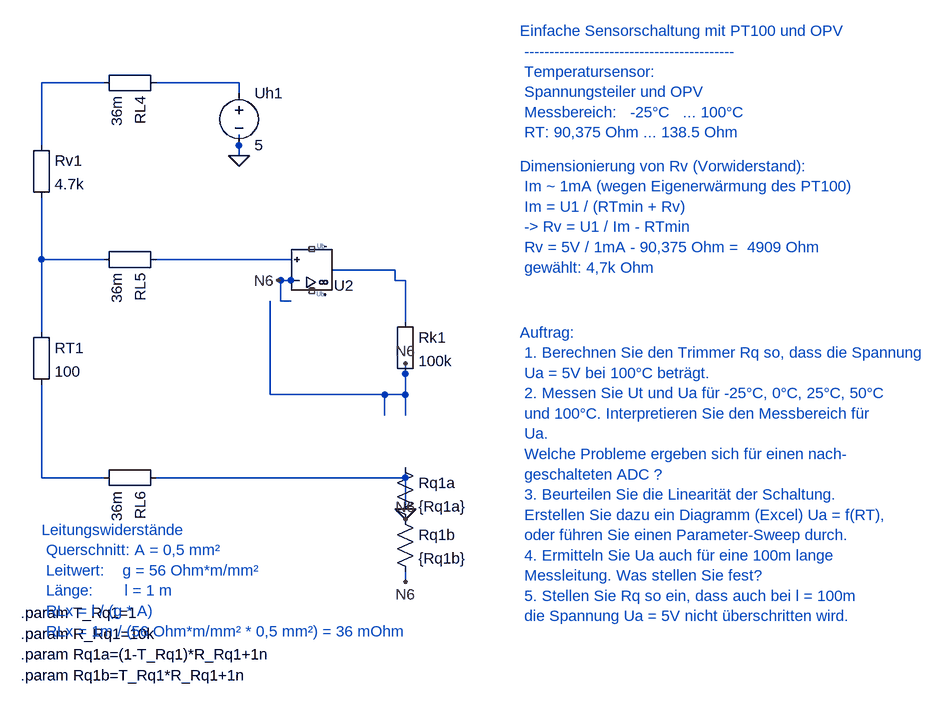
[diagram p0: schematic 1_2_PT100-Sensor_mit_OPV.asc]
1_2_PT100-Sensor_mit_OPV.asc, the LTspice schematic file:
Version 4
SHEET 1 880 680
WIRE 480 448 464 448
WIRE 464 448 464 480
WIRE 464 480 480 480
WIRE 544 432 640 432
WIRE 640 432 640 448
WIRE 400 240 400 224
WIRE 192 144 96 144
WIRE 96 144 96 240
WIRE 96 416 96 528
WIRE 192 416 96 416
WIRE 96 608 96 752
WIRE 96 752 192 752
WIRE 656 512 656 448
WIRE 656 448 640 448
WIRE 656 592 656 624
WIRE 656 800 656 752
WIRE 400 160 400 144
WIRE 400 144 272 144
WIRE 400 224 400 256
WIRE 272 416 480 416
WIRE 96 320 96 416
WIRE 656 624 624 624
WIRE 656 656 656 624
WIRE 624 624 448 624
WIRE 448 624 448 480
WIRE 624 656 624 624
WIRE 656 752 272 752
WIRE 656 736 656 752
WIRE 656 592 656 576
WIRE 656 896 656 912
WIRE 480 448 460 448
FLAG 400 256 0
FLAG 656 800 0
FLAG 656 800 0
FLAG 400 256 0
FLAG 656 576 N6
FLAG 656 912 N6
FLAG 460 448 N6
FLAG 656 816 N6
SYMBOL UniversalOpAmp2 512 432 M180
SYMATTR InstName U2
SYMATTR Value UniversalOpAmp2
SYMBOL Misc\EuropeanResistor 80 512 R0
SYMATTR InstName RT1
SYMATTR Value 100
SYMBOL Misc\EuropeanResistor 288 128 R90
SYMATTR InstName RL4
SYMATTR Value 36m
SYMBOL Misc\EuropeanResistor 288 400 R90
SYMATTR InstName RL5
SYMATTR Value 36m
SYMBOL Misc\EuropeanResistor 288 736 R90
SYMATTR InstName RL6
SYMATTR Value 36m
SYMBOL Misc\EuropeanResistor 640 496 R0
SYMATTR InstName Rk1
SYMATTR Value 100k
SYMBOL voltage 400 144 R0
SYMATTR InstName Uh1
SYMATTR Value 5
SYMBOL Misc\EuropeanResistor 80 224 R0
SYMATTR InstName Rv1
SYMATTR Value 4.7k
SYMBOL res 640 720 R0
SYMATTR InstName Rq1a
SYMATTR Value {Rq1a}
SYMBOL res 640 800 R0
SYMATTR InstName Rq1b
SYMATTR Value {Rq1b}
TEXT 64 960 Left 2 !.param T_Rq1=1
TEXT 64 992 Left 2 !.param R_Rq1=10k
TEXT 64 1024 Left 2 !.param Rq1a=(1-T_Rq1)*R_Rq1+1n
TEXT 64 1056 Left 2 !.param Rq1b=T_Rq1*R_Rq1+1n
TEXT 832 64 Left 2 ;Einfache Sensorschaltung mit PT100 und OPV \n ------------------------------------------ \n Temperatursensor: \n Spannungsteiler und OPV \n Messbereich:   -25°C   ... 100°C \n RT: 90,375 Ohm ... 138.5 Ohm
TEXT 96 832 Left 2 ;Leitungswiderstände \n Querschnitt: A = 0,5 mm² \n Leitwert:    g = 56 Ohm*m/mm² \n Länge:       l = 1 m \n RLx = l / (g * A) \n RLx = 1m / (56 Ohm*m/mm² * 0,5 mm²) = 36 mOhm
TEXT 832 272 Left 2 ;Dimensionierung von Rv (Vorwiderstand): \n Im ~ 1mA (wegen Eigenerwärmung des PT100) \n Im = U1 / (RTmin + Rv) \n -> Rv = U1 / Im - RTmin \n Rv = 5V / 1mA - 90,375 Ohm =  4909 Ohm \n gewählt: 4,7k Ohm
TEXT 832 528 Left 2 ;Auftrag: \n 1. Berechnen Sie den Trimmer Rq so, dass die Spannung \n Ua = 5V bei 100°C beträgt. \n 2. Messen Sie Ut und Ua für -25°C, 0°C, 25°C, 50°C \n und 100°C. Interpretieren Sie den Messbereich für \n Ua. \n Welche Probleme ergeben sich für einen nach- \n geschalteten ADC ? \n 3. Beurteilen Sie die Linearität der Schaltung. \n Erstellen Sie dazu ein Diagramm (Excel) Ua = f(RT), \n oder führen Sie einen Parameter-Sweep durch. \n 4. Ermitteln Sie Ua auch für eine 100m lange \n Messleitung. Was stellen Sie fest? \n 5. Stellen Sie Rq so ein, dass auch bei l = 100m \n die Spannung Ua = 5V nicht überschritten wird.

The netlist it stands for:
* 1_2_PT100-Sensor_mit_OPV.asc
XU2 N006 N6 NC_01 NC_02 N001 level2 UniversalOpAmp2 Avol=1Meg GBW=10Meg Slew=10Meg Ilimit=25m Rail=0 Vos=0 En=0 Enk=0 In=0 Ink=0 Rin=500Meg  ; pins In+ In- V+ V- OUT
RT1 N003 N004 100
RL4 N005 N002 36m
RL5 N006 N003 36m
RL6 0 N004 36m
Rk1 N001 N6 100k
V§Uh1 N005 0 5
Rv1 N002 N003 4.7k
Rq1a 0 N6 {Rq1a}
Rq1b N6 N6 {Rq1b}
.param T_Rq1=1
.param R_Rq1=10k
.param Rq1a=(1-T_Rq1)*R_Rq1+1n
.param Rq1b=T_Rq1*R_Rq1+1n
* Einfache Sensorschaltung mit PT100 und OPV
*  ------------------------------------------
*  Temperatursensor:
*  Spannungsteiler und OPV
*  Messbereich:   -25°C   ... 100°C
*  RT: 90,375 Ohm ... 138.5 Ohm
* Leitungswiderstände
*  Querschnitt: A = 0,5 mm²
*  Leitwert:    g = 56 Ohm*m/mm²
*  Länge:       l = 1 m
*  RLx = l / (g * A)
*  RLx = 1m / (56 Ohm*m/mm² * 0,5 mm²) = 36 mOhm
* Dimensionierung von Rv (Vorwiderstand):
*  Im ~ 1mA (wegen Eigenerwärmung des PT100)
*  Im = U1 / (RTmin + Rv)
*  -> Rv = U1 / Im - RTmin
*  Rv = 5V / 1mA - 90,375 Ohm =  4909 Ohm
*  gewählt: 4,7k Ohm
* Auftrag:
*  1. Berechnen Sie den Trimmer Rq so, dass die Spannung
*  Ua = 5V bei 100°C beträgt.
*  2. Messen Sie Ut und Ua für -25°C, 0°C, 25°C, 50°C
*  und 100°C. Interpretieren Sie den Messbereich für
*  Ua.
*  Welche Probleme ergeben sich für einen nach-
*  geschalteten ADC ?
*  3. Beurteilen Sie die Linearität der Schaltung.
*  Erstellen Sie dazu ein Diagramm (Excel) Ua = f(RT),
*  oder führen Sie einen Parameter-Sweep durch.
*  4. Ermitteln Sie Ua auch für eine 100m lange
*  Messleitung. Was stellen Sie fest?
*  5. Stellen Sie Rq so ein, dass auch bei l = 100m
*  die Spannung Ua = 5V nicht überschritten wird.
.lib UniversalOpAmp2.lib
.backanno
.end